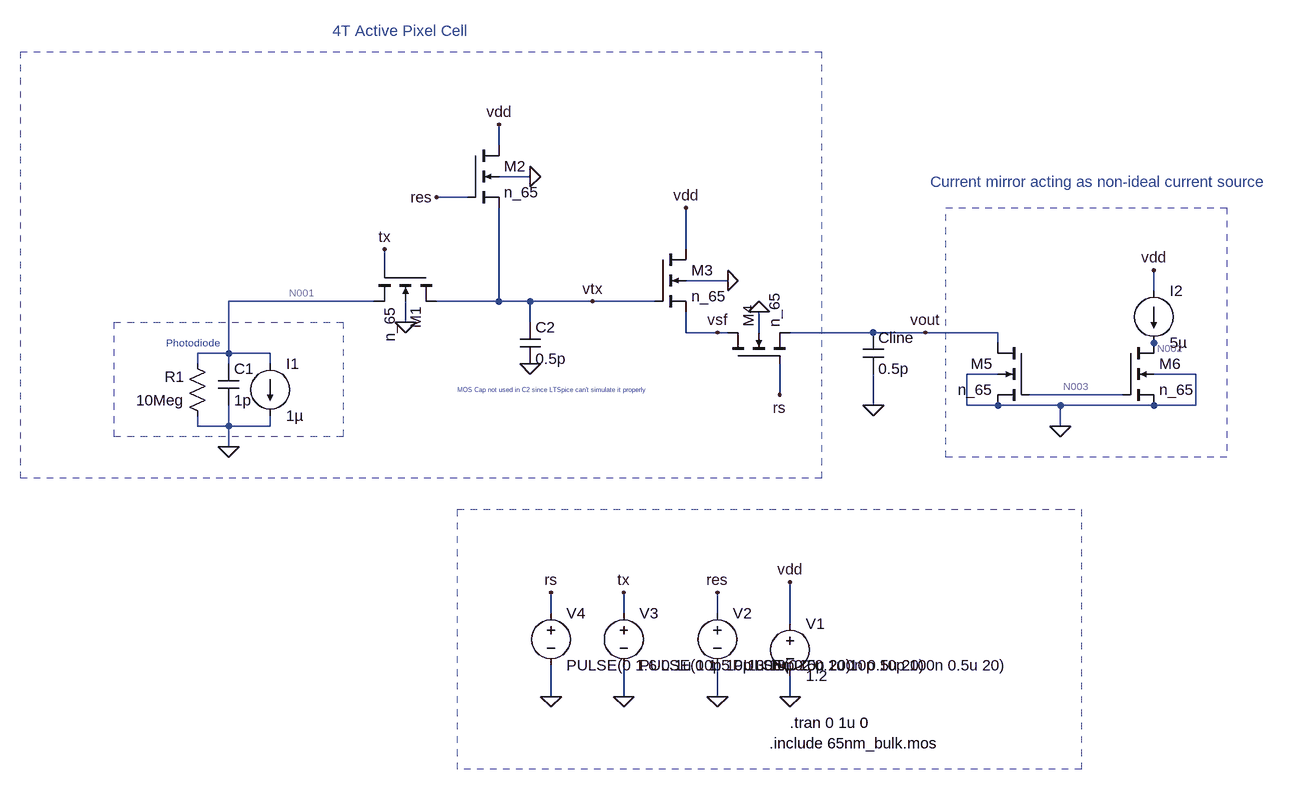
[diagram p0: schematic 4T_Pixel.asc]
4T_Pixel.asc, the LTspice schematic file:
Version 4.1
SHEET 1 1688 772
WIRE 448 -192 448 -224
WIRE 496 -144 448 -144
WIRE 400 -112 352 -112
WIRE 736 -32 736 -96
WIRE 272 0 272 -32
WIRE 800 16 736 16
WIRE 1456 32 1456 0
WIRE 256 48 32 48
WIRE 448 48 448 -96
WIRE 448 48 352 48
WIRE 496 48 448 48
WIRE 592 48 496 48
WIRE 688 48 592 48
WIRE 304 80 304 48
WIRE 496 80 496 48
WIRE 736 96 736 64
WIRE 784 96 736 96
WIRE 800 96 784 96
WIRE 848 96 848 64
WIRE 1024 96 896 96
WIRE 1104 96 1024 96
WIRE 1216 96 1104 96
WIRE 1216 112 1216 96
WIRE 32 128 32 48
WIRE 32 128 -16 128
WIRE 96 128 32 128
WIRE 1456 128 1456 112
WIRE -16 144 -16 128
WIRE 32 144 32 128
WIRE 96 144 96 128
WIRE 1216 160 1168 160
WIRE 1520 160 1456 160
WIRE 880 192 880 144
WIRE 1408 192 1264 192
WIRE 1024 208 1024 160
WIRE 1168 208 1168 160
WIRE 1216 208 1168 208
WIRE 1312 208 1216 208
WIRE 1456 208 1312 208
WIRE 1520 208 1520 160
WIRE 1520 208 1456 208
WIRE -16 240 -16 224
WIRE 32 240 32 208
WIRE 32 240 -16 240
WIRE 96 240 96 224
WIRE 96 240 32 240
WIRE 1312 240 1312 208
WIRE 32 272 32 240
WIRE 528 528 528 496
WIRE 640 528 640 496
WIRE 784 528 784 496
WIRE 896 544 896 480
WIRE 528 656 528 608
WIRE 640 656 640 608
WIRE 784 656 784 608
WIRE 896 656 896 624
FLAG 32 272 0
FLAG 272 -32 tx
FLAG 304 80 0
FLAG 352 -112 res
FLAG 496 -144 0
FLAG 448 -224 vdd
FLAG 496 144 0
FLAG 800 16 0
FLAG 736 -96 vdd
FLAG 848 64 0
FLAG 880 192 rs
FLAG 896 656 0
FLAG 896 480 vdd
FLAG 784 656 0
FLAG 784 496 res
FLAG 640 656 0
FLAG 640 496 tx
FLAG 1024 208 0
FLAG 528 656 0
FLAG 528 496 rs
FLAG 1312 240 0
FLAG 1456 0 vdd
FLAG 1104 96 vout
FLAG 592 48 vtx
FLAG 784 96 vsf
SYMBOL current 96 144 R0
WINDOW 123 0 0 Left 0
WINDOW 39 0 0 Left 0
SYMATTR InstName I1
SYMATTR Value 1µ
SYMBOL cap 16 144 R0
SYMATTR InstName C1
SYMATTR Value 1p
SYMBOL res 0 240 R180
WINDOW 0 36 76 Left 2
WINDOW 3 36 40 Left 2
SYMATTR InstName R1
SYMATTR Value 10Meg
SYMBOL nmos4 352 0 R90
SYMATTR InstName M1
SYMATTR Value n_65
SYMATTR Value2 l=2u w=1u
SYMBOL nmos4 400 -192 R0
SYMATTR InstName M2
SYMATTR Value n_65
SYMATTR Value2 l=65n w=1u
SYMBOL nmos4 688 -32 R0
SYMATTR InstName M3
SYMATTR Value n_65
SYMATTR Value2 l=65n w=4u
SYMBOL nmos4 800 144 R270
SYMATTR InstName M4
SYMATTR Value n_65
SYMATTR Value2 l=65n w=4u
SYMBOL voltage 896 528 R0
WINDOW 123 0 0 Left 0
WINDOW 39 0 0 Left 0
SYMATTR InstName V1
SYMATTR Value 1.2
SYMBOL voltage 784 512 R0
WINDOW 123 0 0 Left 0
WINDOW 39 0 0 Left 0
SYMATTR InstName V2
SYMATTR Value PULSE(0 2 0.1u 10p 10p 100n 0.5u 20)
SYMBOL cap 480 80 R0
SYMATTR InstName C2
SYMATTR Value 0.5p
SYMBOL voltage 640 512 R0
WINDOW 123 0 0 Left 0
WINDOW 39 0 0 Left 0
SYMATTR InstName V3
SYMATTR Value PULSE(0 1.5 0.1u 10p 10p 200n 0.5u 20)
SYMBOL cap 1008 96 R0
SYMATTR InstName Cline
SYMATTR Value 0.5p
SYMBOL current 1456 32 R0
WINDOW 123 0 0 Left 0
WINDOW 39 0 0 Left 0
SYMATTR InstName I2
SYMATTR Value 5µ
SYMBOL voltage 528 512 R0
WINDOW 123 0 0 Left 0
WINDOW 39 0 0 Left 0
SYMATTR InstName V4
SYMATTR Value PULSE(0 1.6 0.1u 10p 10p 300n 0.5u 20)
SYMBOL nmos4 1264 112 M0
SYMATTR InstName M5
SYMATTR Value n_65
SYMATTR Value2 l=65n w=2u
SYMBOL nmos4 1408 112 R0
SYMATTR InstName M6
SYMATTR Value n_65
SYMATTR Value2 l=65n w=2u
TEXT -64 112 Left 1 ;Photodiode
TEXT 192 -368 Left 2 ;4T Active Pixel Cell
TEXT 896 696 Left 2 !.tran 0 1u 0
TEXT 864 728 Left 2 !.include 65nm_bulk.mos
TEXT 384 184 Left 0 ;MOS Cap not used in C2 since LTSpice can't simulate it properly
TEXT 1112 -136 Left 2 ;Current mirror acting as non-ideal current source
RECTANGLE Normal 208 256 -144 80 2
RECTANGLE Normal 944 320 -288 -336 2
RECTANGLE Normal 1568 288 1136 -96 2
RECTANGLE Normal 1344 768 384 368 2

The netlist it stands for:
* 4T_Pixel.asc
I1 N001 0 1µ
C1 N001 0 1p
R1 0 N001 10Meg
M1 vtx tx N001 0 n_65 l=2u w=1u
M2 vdd res vtx 0 n_65 l=65n w=1u
M3 vdd vtx vsf 0 n_65 l=65n w=4u
M4 vsf rs vout 0 n_65 l=65n w=4u
V1 vdd 0 1.2
V2 res 0 PULSE(0 2 0.1u 10p 10p 100n 0.5u 20)
C2 vtx 0 0.5p
V3 tx 0 PULSE(0 1.5 0.1u 10p 10p 200n 0.5u 20)
Cline vout 0 0.5p
I2 vdd N002 5µ
V4 rs 0 PULSE(0 1.6 0.1u 10p 10p 300n 0.5u 20)
M5 vout N003 0 0 n_65 l=65n w=2u
M6 N002 N003 0 0 n_65 l=65n w=2u
.model NMOS NMOS
.model PMOS PMOS
.lib standard.mos
* Photodiode
* 4T Active Pixel Cell
.tran 0 1u 0
.include 65nm_bulk.mos
* MOS Cap not used in C2 since LTSpice can't simulate it properly
* Current mirror acting as non-ideal current source
.backanno
.end

* Results of the author's LTspice run, read from the files saved beside the schematic
* Operating Point, zero values left out:
*   V(vtx) = -71.94 mV
*   V(vdd) = 1.2 V
*   V(n003) = 223.4 mV
*   V(n001) = -366.7 mV
*   V(vsf) = 52.83 mV
*   V(vout) = 201.5 µV
*   V(n002) = 545 mV
*   I(I1) = 1 µA
*   I(V1) = -5.979 µA
*   I(I2) = 5 µA
*   Id(M6) = 5 µA
*   Ig(M6) = -23.3 pA
*   Is(M6) = -5 µA
*   I(R1) = 36.67 nA
*   Id(M2) = 928.1 nA
*   Ig(M2) = -7.043 nA
*   Is(M2) = -921 nA
*   Ib(M2) = -95.25 pA
*   Id(M3) = 50.54 nA
*   Ig(M3) = -42.07 nA
*   Is(M3) = -8.467 nA
*   Ib(M3) = -2.594 pA
*   I(V3) = -93.82 pA
*   Id(M1) = 963.1 nA
*   Ig(M1) = 93.82 pA
*   Is(M1) = -963.3 nA
*   Ib(M1) = 158.7 pA
*   Id(M4) = 8.467 nA
*   Is(M4) = -8.466 nA
*   Id(M5) = 8.466 nA
*   Ig(M5) = 23.07 pA
*   Is(M5) = -8.49 nA
*   I(V2) = 7.043 nA
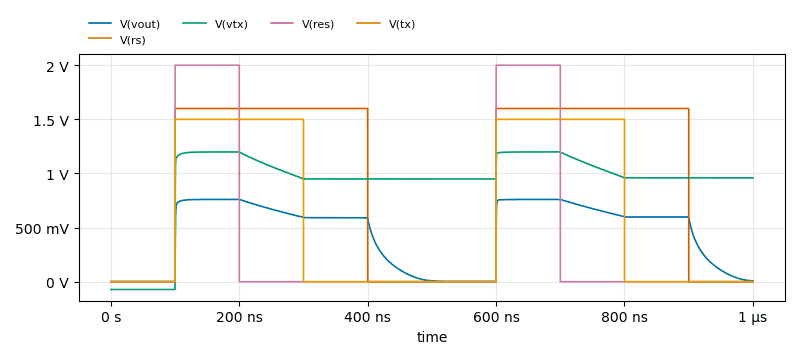
[diagram p1: Transient Analysis of 4T_Pixel.asc, plotted from the saved traces]
* Transient Analysis, 1 run:
*   V(vout): min 201.5 µV, max 760.4 mV, average 436.5 mV, rms 534.4 mV, last 7.216 mV
*   V(rs): min 0 V, max 1.6 V, average 960 mV, rms 1.239 V, last 0 V
*   V(vtx): min -71.94 mV, max 1.199 V, average 922.4 mV, rms 985.2 mV, last 958.9 mV
*   V(res): min 0 V, max 2 V, average 400 mV, rms 894.5 mV, last 0 V
*   V(tx): min 0 V, max 1.5 V, average 600 mV, rms 948.7 mV, last 0 V